# EAGLE schematic brick_i2c_lcd (EAGLE 7.4.0)
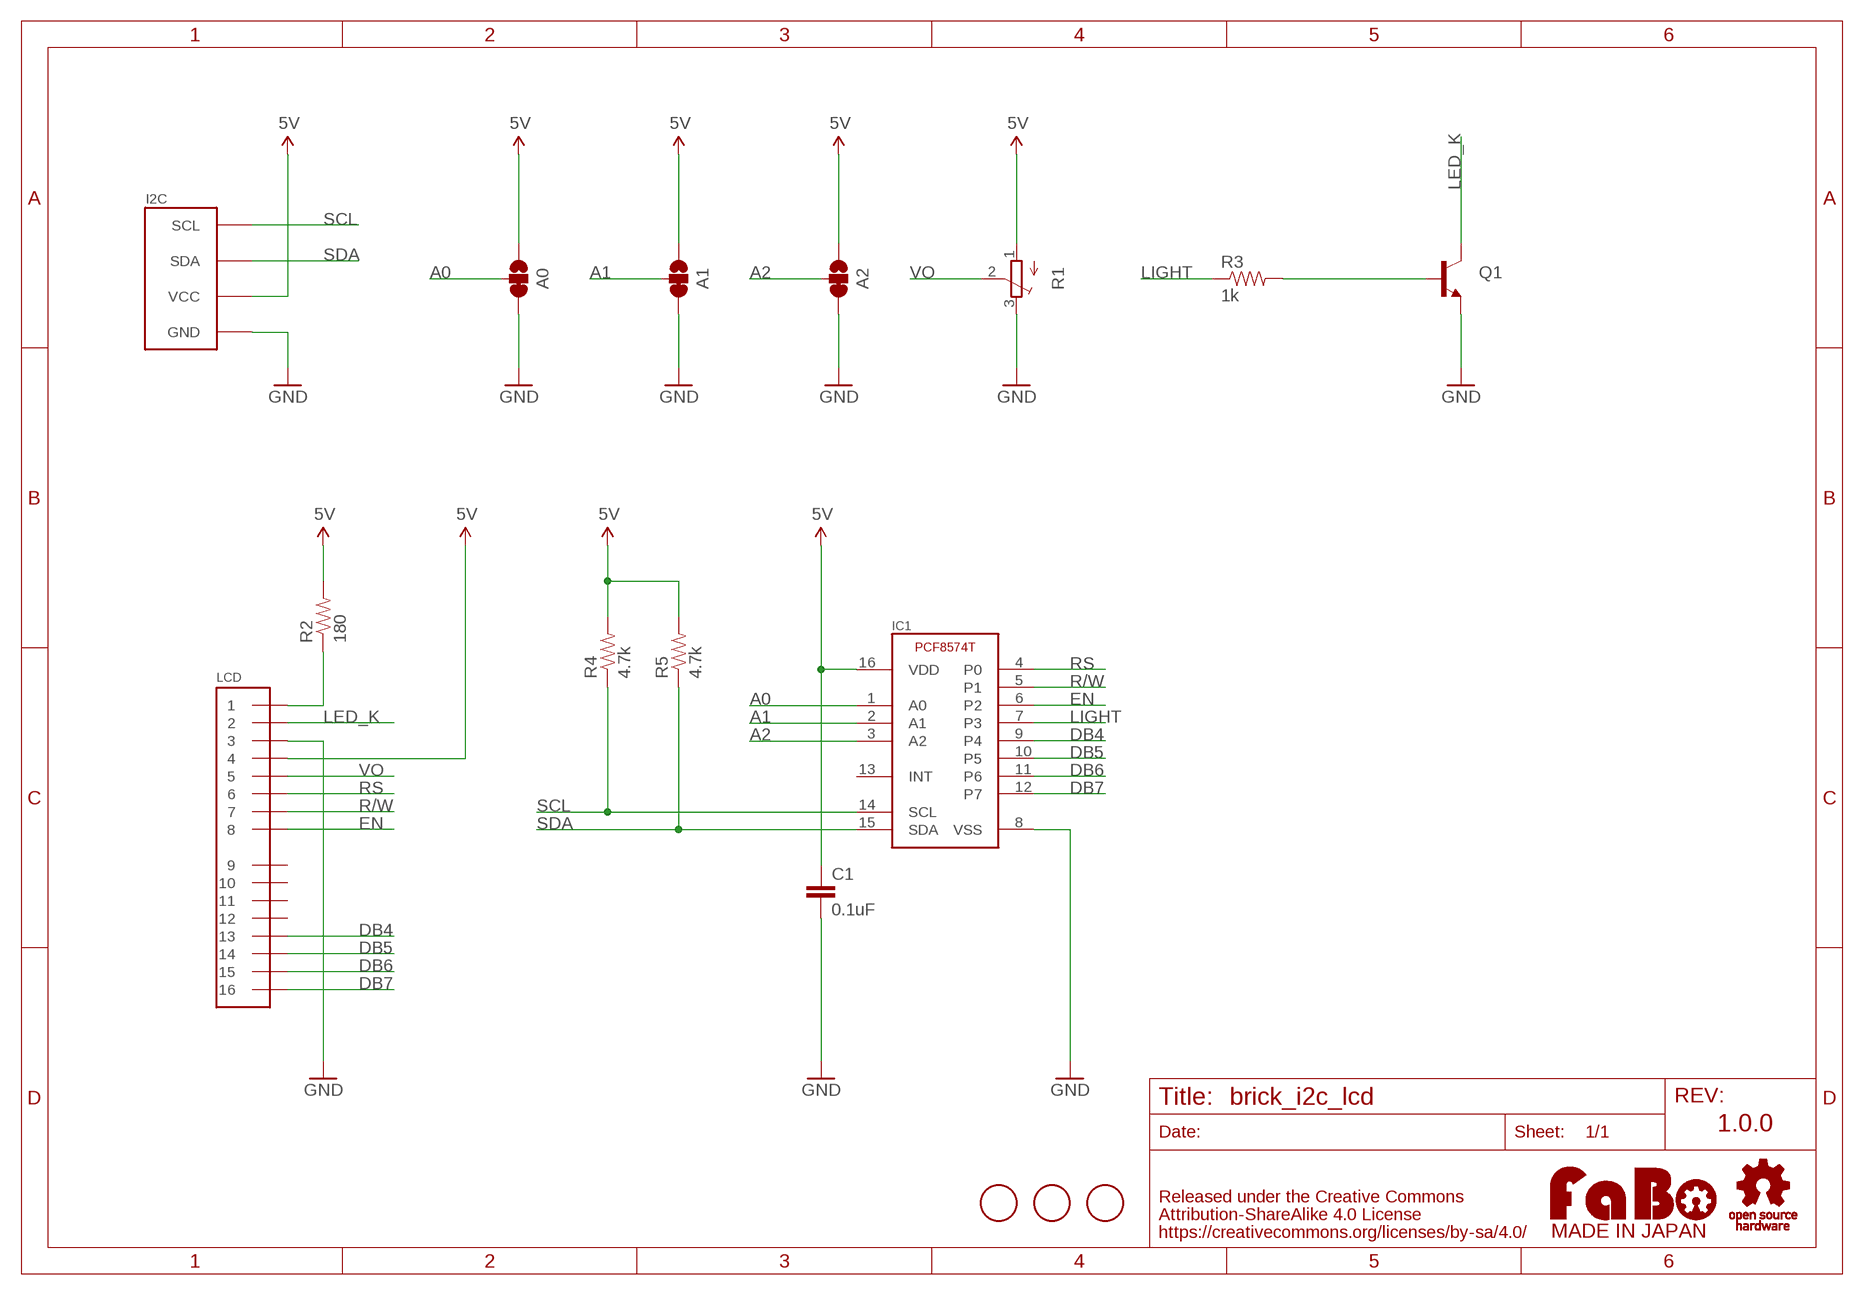
[diagram p0: schematic, sheet 1]

## Parts
A0  SMD-JUMPER-3-23SHORT  [SMD-JUMPER-3]
A1  SMD-JUMPER-3-23SHORT  [SMD-JUMPER-3]
A2  SMD-JUMPER-3-23SHORT  [SMD-JUMPER-3]
C1  0.1uF  CAP-EIA0603  [EIA0603]
I2C  FABO_BRICK_I2C-CONNECTOR  [FABO_BRICK_I2C_CONNECTOR]
IC1  PCF8574T  [SO16]
LCD  PINHEAD_1X16  [PIN_1X16]
Q1  BC850  [SOT23]
R1  TRIMPOTTC33X  [TC33X]
R2  180  RES-EIA0603  [EIA0603]
R3  1k  RES-EIA0603  [EIA0603]
R4  4.7k  RES-EIA0603  [EIA0603]
R5  4.7k  RES-EIA0603  [EIA0603]
U$2  LOGO_OSHW-M  [LOGO_OSHW_M]
U$3  LOGO_FABO-M  [LOGO_FABO_M]
U$4  SCREW-PAD-3MM  [SCREWPAD_3MM]
U$6  SCREW-PAD-3MM  [SCREWPAD_3MM]
U$7  SCREW-PAD-3MM  [SCREWPAD_3MM]

## Nets
5V: A0.1 A1.1 A2.1 C1.1 I2C.VCC IC1.16(VDD) LCD.4 R1.1(A) R2.2 R4.2 R5.2
A0: A0.2 IC1.1(A0)
A1: A1.2 IC1.2(A1)
A2: A2.2 IC1.3(A2)
BASE: Q1.1(B) R3.2
DB4: IC1.9(P4) LCD.13
DB5: IC1.10(P5) LCD.14
DB6: IC1.11(P6) LCD.15
DB7: IC1.12(P7) LCD.16
EN: IC1.6(P2) LCD.8
GND: A0.3 A1.3 A2.3 C1.2 I2C.GND IC1.8(VSS) LCD.3 Q1.2(E) R1.3(E)
LED_A: LCD.1 R2.1
LED_K: LCD.2 Q1.3(C)
LIGHT: IC1.7(P3) R3.1
R/W: IC1.5(P1) LCD.7
RS: IC1.4(P0) LCD.6
SCL: I2C.SCL IC1.14(SCL) R4.1
SDA: I2C.SDA IC1.15(SDA) R5.1
VO: LCD.5 R1.2(S)
Unconnected: IC1.13(INT) LCD.9 LCD.10 LCD.11 LCD.12

## Notes on the sheet
- 1.0.0

## Library data of the parts
A0 A1 A2 = FaBo-etc:SMD-JUMPER-3-23SHORT
C1 = FaBo-etc:CAP: Capacitor Standard 0603 ceramic capacitor
I2C = FaBo-Template:FABO_BRICK_I2C: FaBo Brick I2C
IC1 = FaBo-etc:PCF8574T
LCD = FaBo-etc:PINHEAD_1X16
Q1 = transistor:BC850: NPN TRANSISTOR
R1 = adafruit:TRIMPOT: SMT trimmer potentiometer part number TC33X http://www.ladyada.net/library/eagle
R2-R5 = FaBo-etc:RES
U$2 = FaBo-etc:LOGO_OSHW
U$3 = FaBo-etc:LOGO_FABO
U$4 U$6 U$7 = FaBo-etc:SCREW-PAD